# EAGLE design ThermistorCPTSCHEMATIC (EAGLE 7.5.0)
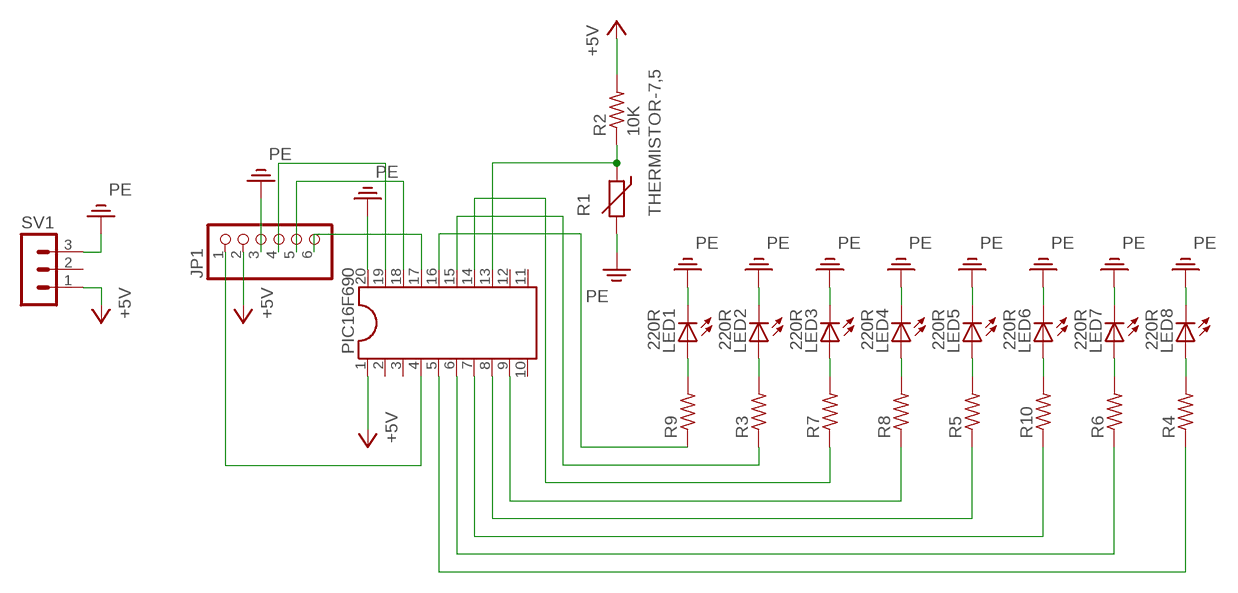
[diagram p0: schematic, sheet 1]

## Parts
JP1  PINHD-1X6  [1X06]
LED1  220R  LED5MM  [LED5MM]
LED2  220R  LED5MM  [LED5MM]
LED3  220R  LED5MM  [LED5MM]
LED4  220R  LED5MM  [LED5MM]
LED5  220R  LED5MM  [LED5MM]
LED6  220R  LED5MM  [LED5MM]
LED7  220R  LED5MM  [LED5MM]
LED8  220R  LED5MM  [LED5MM]
PIC16F690  DIL20  [DIL20]
R1  THERMISTOR-7,5  [R-7,5]
R2  10K  R-US_0207/10  [0207/10]
R3  R-US_0207/10  [0207/10]
R4  R-US_0207/10  [0207/10]
R5  R-US_0207/10  [0207/10]
R6  R-US_0207/10  [0207/10]
R7  R-US_0207/10  [0207/10]
R8  R-US_0207/10  [0207/10]
R9  R-US_0207/10  [0207/10]
R10  R-US_0207/10  [0207/10]
SV1  MA03-1  [MA03-1]

## Nets
+5V: JP1.2 PIC16F690.1 R2.2 SV1.1
N$1: PIC16F690.14 R7.1
N$2: JP1.4 PIC16F690.19
N$3: JP1.5 PIC16F690.18
N$4: JP1.6 PIC16F690.17
N$5: LED7.A R6.2
N$6: LED8.A R4.2
N$7: LED6.A R10.2
N$8: LED5.A R5.2
N$9: LED4.A R8.2
N$10: LED3.A R7.2
N$11: LED2.A R3.2
N$12: LED1.A R9.2
N$13: PIC16F690.16 R9.1
N$14: PIC16F690.15 R3.1
N$15: PIC16F690.9 R8.1
N$16: PIC16F690.8 R5.1
N$17: JP1.1 PIC16F690.4
N$18: PIC16F690.7 R10.1
N$19: PIC16F690.6 R6.1
N$20: PIC16F690.5 R4.1
N$22: PIC16F690.13 R1.1 R2.1
PE: JP1.3 LED1.K(C) LED2.K(C) LED3.K(C) LED4.K(C) LED5.K(C) LED6.K(C) LED7.K(C) LED8.K(C) PIC16F690.20 R1.2 SV1.3
Unconnected: PIC16F690.2 PIC16F690.3 PIC16F690.10 PIC16F690.11 PIC16F690.12 SV1.2

## Library data of the parts
JP1 = pinhead:PINHD-1X6: PIN HEADER
LED1-LED8 = led:LED: LED OSRAM: - CHIPLED LG R971, LG N971, LY N971, LG Q971, LY Q971, LO R971, LY R971 LH N974, LH R974 LS Q976, LO Q976, LY Q976 LO Q996 - Hyper CHIPLED LW Q18S LB Q993, LB Q99A, LB R99A - SideLED LS A670, LO A670, LY A670, LG A670, LP A670 LB A673, LV A673, LT A673, LW A673 LH A674 LY A675 LS A676, LA A676, LO A676, LY A676, LW A676 LS A679, LY A679, LG A679 - Hyper Micro SIDELED® LS Y876, LA Y876, LO Y876, LY Y876 LT Y87S - SmartLED LW L88C, LW L88S LB L89C, LB L89S, LG L890 LS L89K, LO L89K, LY L89K LS L896, LA L896, LO L896, LY L896 - TOPLED LS T670, LO T670, LY T670, LG T670, LP T670 LSG T670, LSP T670, LSY T670, LOP T670, LYG T670 LG T671, LOG T671, LSG T671 LB T673, LV T673, LT T673, LW T673 LH T674 LS T676, LA T676, LO T676, LY T676, LB T676, LH T676, LSB T676, LW T676 LB T67C, LV T67C, LT T67C, LS T67K, LO T67K, LY T67K, LW E67C LS E67B, LA E67B, LO E67B, LY E67B, LB E67C, LV E67C, LT E67C LW T67C LS T679, LY T679, LG T679 LS T770, LO T770, LY T770, LG T770, LP T770 LB T773, LV T773, LT T773, LW T773 LH T774 LS E675, LA E675, LY E675, LS T675 LS T776, LA T776, LO T776, LY T776, LB T776 LHGB T686 LT T68C, LB T68C - Hyper Mini TOPLED® LB M676 - Mini TOPLED Santana® LG M470 LS M47K, LO M47K, LY M47K Source: http://www.osram.convergy.de LUXEON: - LUMILED® LXK2-PW12-R00, LXK2-PW12-S00, LXK2-PW14-U00, LXK2-PW14-V00 LXK2-PM12-R00, LXK2-PM12-S00, LXK2-PM14-U00 LXK2-PE12-Q00, LXK2-PE12-R00, LXK2-PE12-S00, LXK2-PE14-T00, LXK2-PE14-U00 LXK2-PB12-K00, LXK2-PB12-L00, LXK2-PB12-M00, LXK2-PB14-N00, LXK2-PB14-P00, LXK2-PB14-Q00 LXK2-PR12-L00, LXK2-PR12-M00, LXK2-PR14-Q00, LXK2-PR14-R00 LXK2-PD12-Q00, LXK2-PD12-R00, LXK2-PD12-S00 LXK2-PH12-R00, LXK2-PH12-S00 LXK2-PL12-P00, LXK2-PL12-Q00, LXK2-PL12-R00 Source: www.luxeon.com KINGBRIGHT: KA-3528ASYC Source: www.kingbright.com
PIC16F690 = ic-package:DIL20: Dual In Line / Socket
R1 = varistor:THERMISTOR: THERMISTOR
R2-R10 = rcl:R-US_: RESISTOR, American symbol
SV1 = con-lstb:MA03-1: PIN HEADER; OC_FARNELL: unknown; OC_NEWARK: unknown

## Board
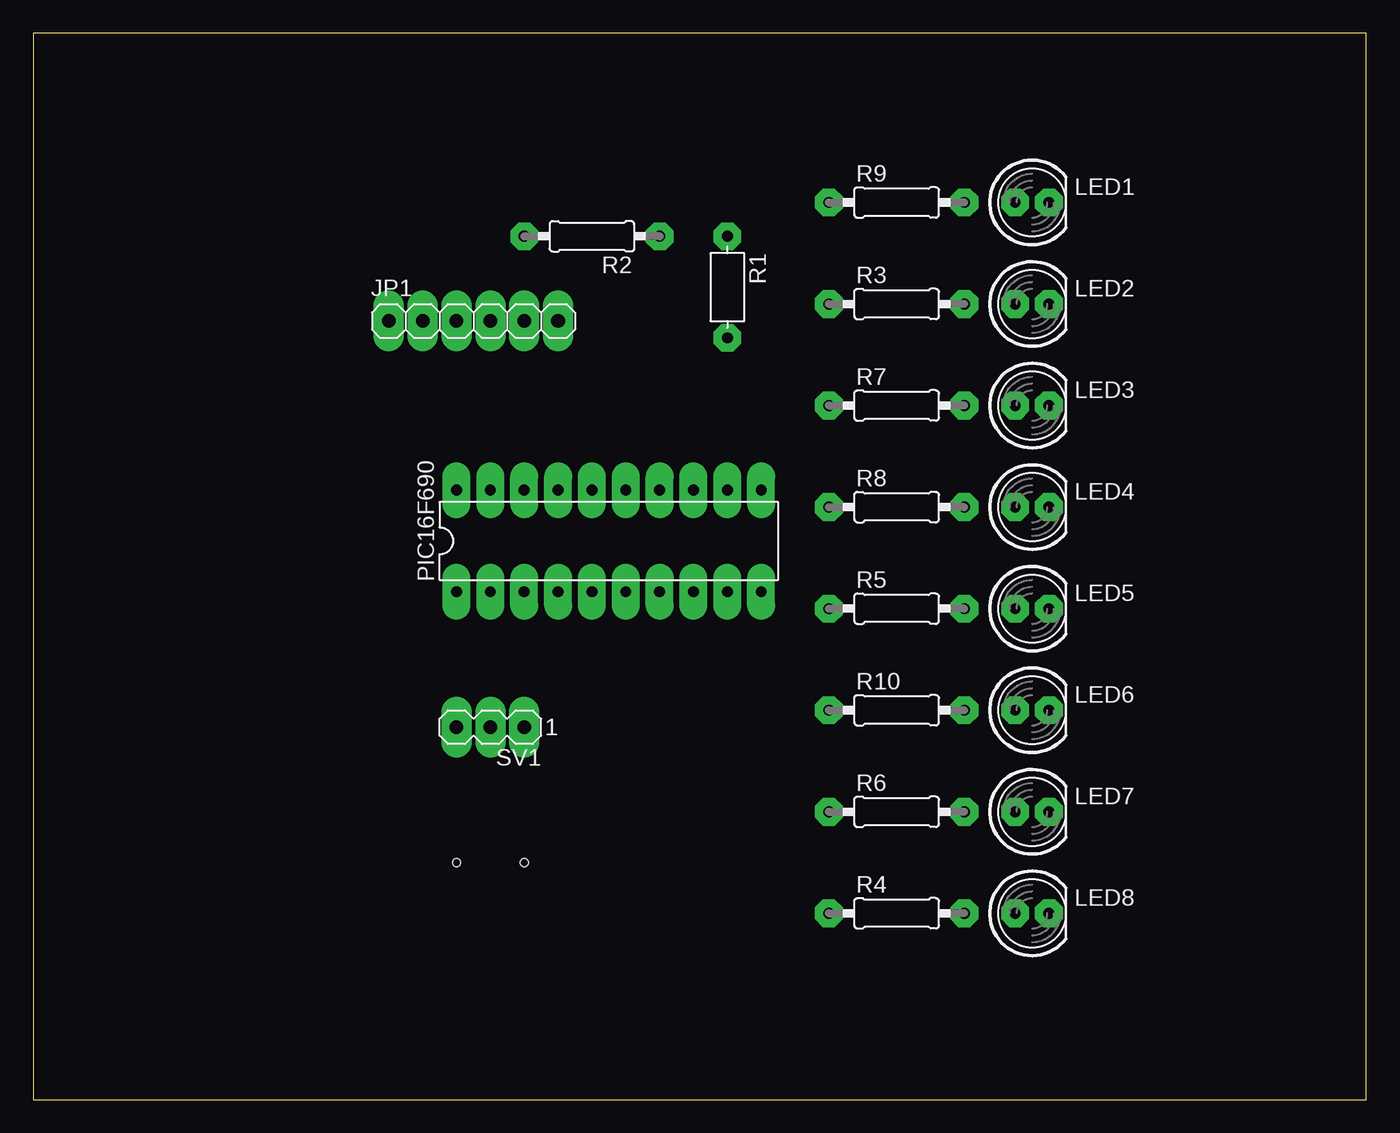
[diagram p1: board, top side]
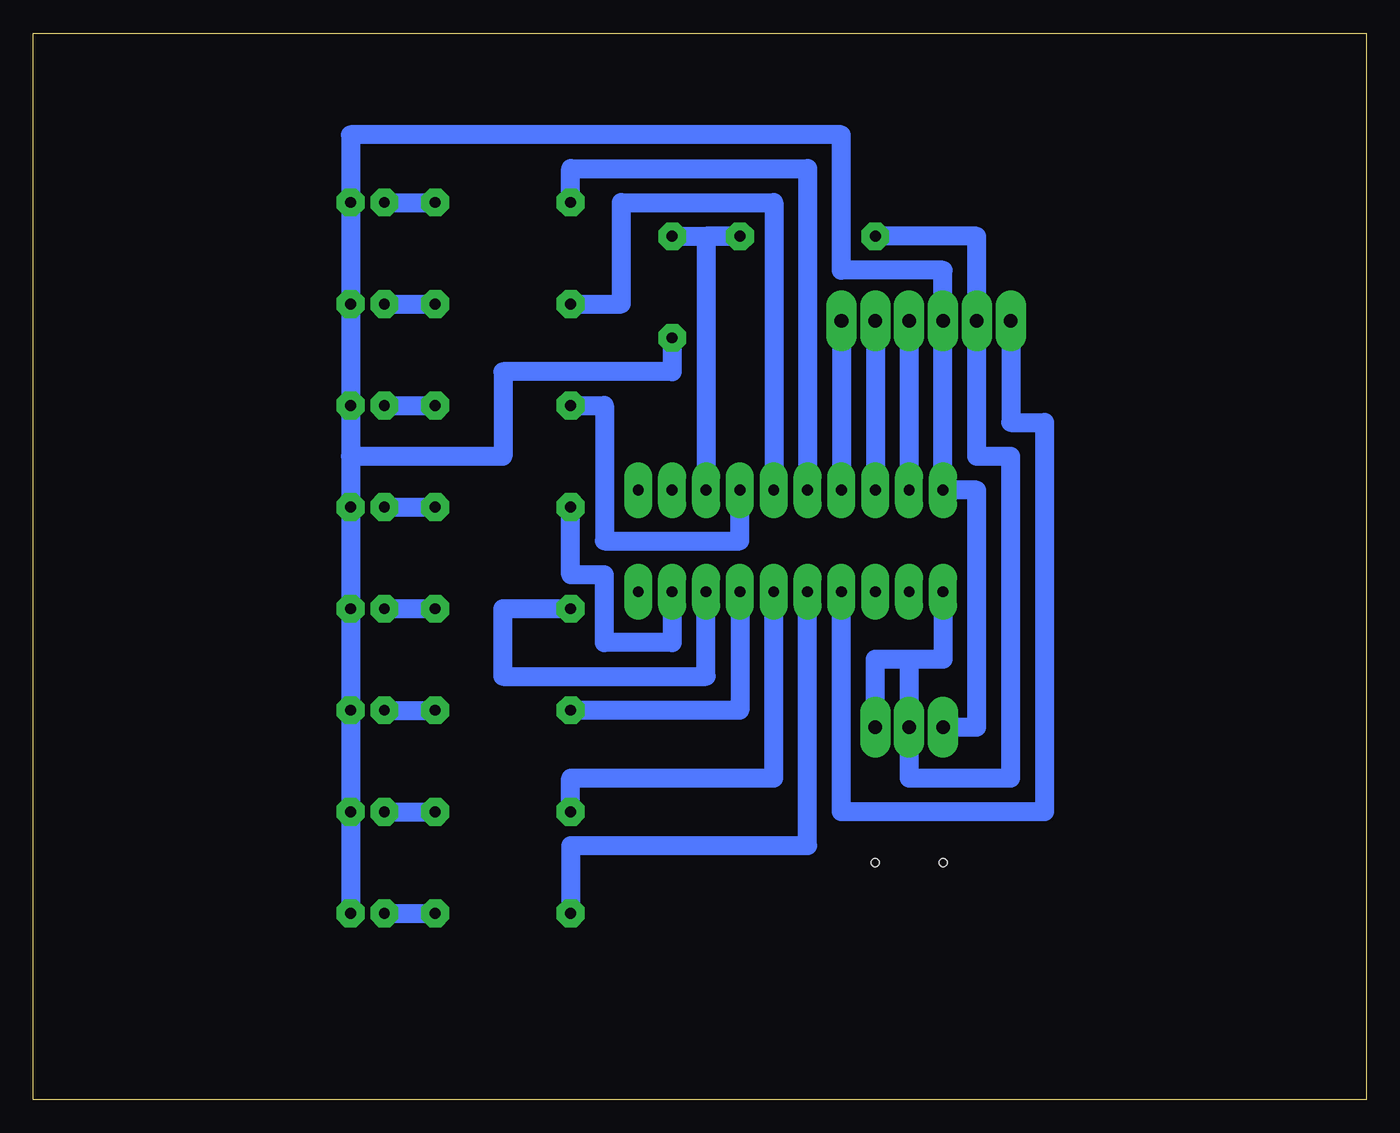
[diagram p2: board, bottom side, seen from below]

Size 100 x 80 mm. Coordinates in mm from the lower left corner, seen from the top.
Outline: 0,0 100,0 100,80 0,80 0,0
Copper layers (1*16): Top 0.035mm / dielectric 1.5mm / Bottom 0.035mm
Design rules "default *": minimum track width 10mil, minimum drill 24mil, track to track 8mil, track to pad 8mil, pad to pad 8mil, via to via 8mil, smd to smd 8mil, copper to edge 40mil, drill to drill 8mil, minimum pad ring 25mil, minimum via ring 8mil, stop-mask expansion 4mil, vias tented up to drill 0mil, thermal gap 10mil
Holes 0.6 mm at 31.75,17.78 36.83,17.78

### Footprints (pad centres in the part's own frame; a part is rotated, then mirrored left to right if it is on the bottom)
1X06 = drill 1.016 long: 1 -6.35,0; 2 -3.81,0; 3 -1.27,0; 4 1.27,0; 5 3.81,0; 6 6.35,0
LED5MM = drill 0.813 octagon: A -1.27,0; K 1.27,0
DIL20 = drill 0.813 long: 1 -11.43,-3.81; 2 -8.89,-3.81; 3 -6.35,-3.81; 4 -3.81,-3.81; 5 -1.27,-3.81; 6 1.27,-3.81; 7 3.81,-3.81; 8 6.35,-3.81; 9 8.89,-3.81; 10 11.43,-3.81; 11 11.43,3.81; 12 8.89,3.81; 13 6.35,3.81; 14 3.81,3.81; 15 1.27,3.81; 16 -1.27,3.81; 17 -3.81,3.81; 18 -6.35,3.81; 19 -8.89,3.81; 20 -11.43,3.81
R-7,5 = drill 0.813 octagon: 1 -3.81,0; 2 3.81,0
0207/10 = drill 0.813 octagon: 1 -5.08,0; 2 5.08,0
MA03-1 = drill 1.016 long: 1 -2.54,0; 2 0,0; 3 2.54,0

### Placement (x,y rotation side)
JP1  33.02,58.42 0 top
LED1  74.93,67.31 0 top
LED2  74.93,59.69 0 top
LED3  74.93,52.07 0 top
LED4  74.93,44.45 0 top
LED5  74.93,36.83 0 top
LED6  74.93,29.21 0 top
LED7  74.93,21.59 0 top
LED8  74.93,13.97 0 top
PIC16F690  43.18,41.91 0 top
R1  52.07,60.96 270 top
R2  41.91,64.77 180 top
R3  64.77,59.69 0 top
R4  64.77,13.97 0 top
R5  64.77,36.83 0 top
R6  64.77,21.59 0 top
R7  64.77,52.07 0 top
R8  64.77,44.45 0 top
R9  64.77,67.31 0 top
R10  64.77,29.21 0 top
SV1  34.29,27.94 180 top

### Tracks (layer width: path | path; a pad name or v marks a point on that pad's centre or on a via)
+5V
  Bottom 1.422: R2.2 29.21,64.77 JP1.2 29.21,48.26 26.67,48.26 26.67,24.13 34.29,24.13 34.29,33.02 | SV1.1 36.83,33.02 34.29,33.02 | PIC16F690.1 31.75,33.02 34.29,33.02
N$1
  Bottom 1.422: PIC16F690.14 46.99,41.91 57.15,41.91 57.15,52.07 R7.1
N$2
  Bottom 1.422: JP1.4 PIC16F690.19
N$3
  Bottom 1.422: JP1.5 PIC16F690.18
N$4
  Bottom 1.422: JP1.6 PIC16F690.17
N$5
  Bottom 1.422: LED7.A R6.2
N$6
  Bottom 1.422: LED8.A R4.2
N$7
  Bottom 1.422: LED6.A R10.2
N$8
  Bottom 1.422: LED5.A R5.2
N$9
  Bottom 1.422: LED4.A R8.2
N$10
  Bottom 1.422: LED3.A R7.2
N$11
  Bottom 1.422: LED2.A R3.2
N$12
  Bottom 1.422: LED1.A R9.2
N$13
  Bottom 1.422: R9.1 59.69,69.85 41.91,69.85 PIC16F690.16
N$14
  Bottom 1.422: PIC16F690.15 44.45,67.31 55.88,67.31 55.88,59.69 R3.1
N$15
  Bottom 1.422: PIC16F690.9 52.07,34.29 57.15,34.29 57.15,39.37 59.69,39.37 R8.1
N$16
  Bottom 1.422: PIC16F690.8 49.53,31.75 64.77,31.75 64.77,36.83 R5.1
N$17
  Bottom 1.422: JP1.1 26.67,50.8 24.13,50.8 24.13,21.59 39.37,21.59 PIC16F690.4
N$18
  Bottom 1.422: PIC16F690.7 46.99,29.21 R10.1
N$19
  Bottom 1.422: R6.1 59.69,24.13 44.45,24.13 PIC16F690.6
N$20
  Bottom 1.422: PIC16F690.5 41.91,19.05 59.69,19.05 R4.1
N$22
  Bottom 1.422: R1.1 R2.1 49.53,64.77 PIC16F690.13
PE
  Bottom 1.422: 76.2,48.26 LED3.K LED2.K LED1.K 76.2,72.39 39.37,72.39 39.37,62.23 31.75,62.23 JP1.3 PIC16F690.20 29.21,45.72 29.21,27.94 SV1.3 | 76.2,48.26 LED4.K LED5.K LED6.K LED7.K LED8.K | R1.2 52.07,54.61 64.77,54.61 64.77,48.26 76.2,48.26